# Altium schematic sheet Stripline_Driver.SchDoc
size A
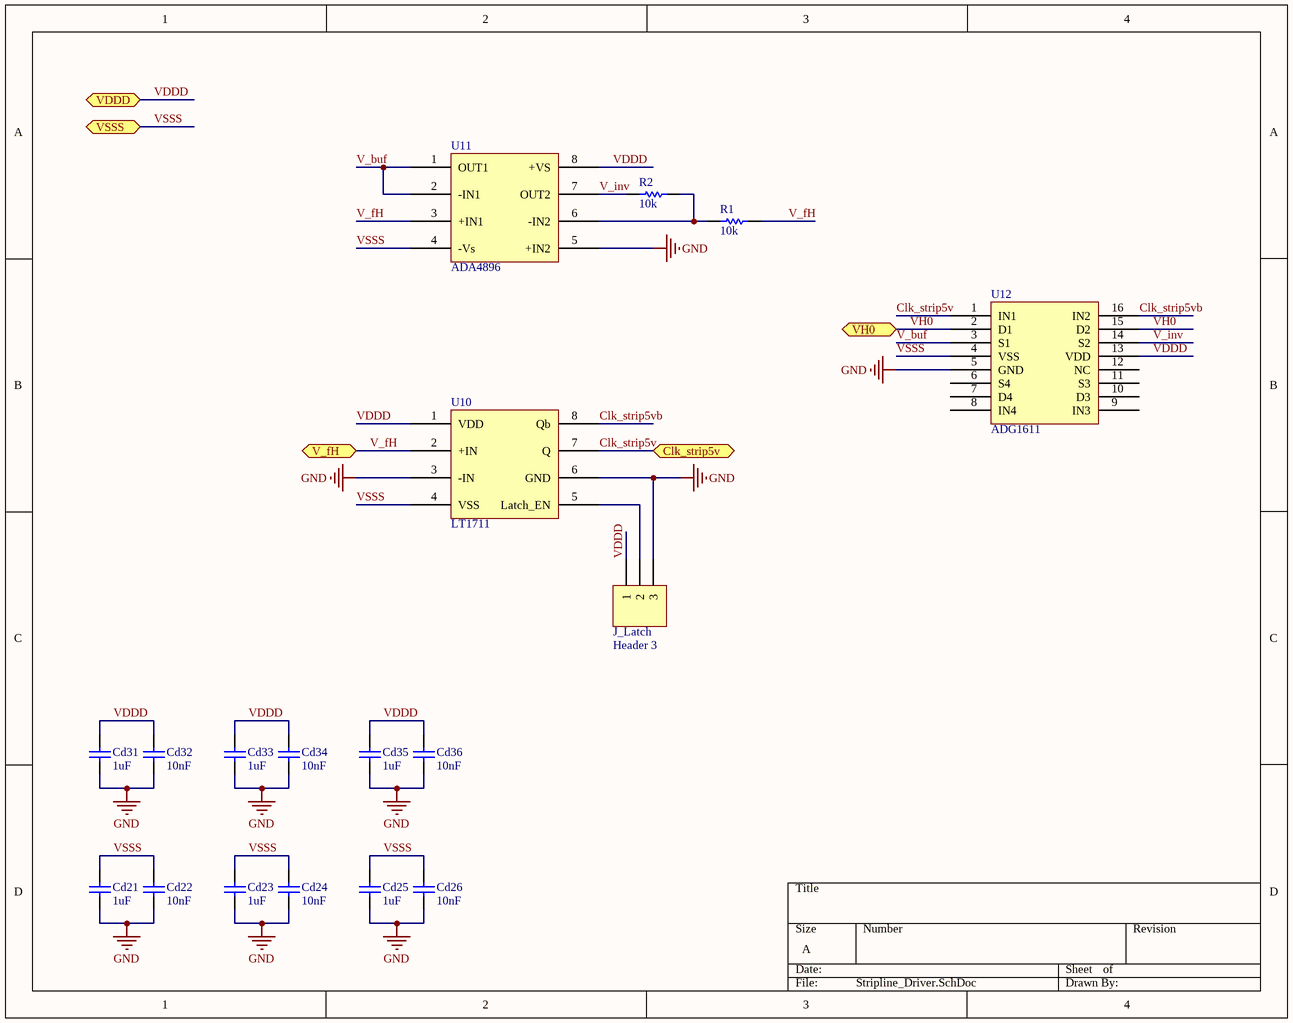
[diagram p0: Stripline_Driver.SchDoc]

## Parts
Cd21  value 1uF  [1608[0603]]  (hidden comment: Cap)
Cd22  value 10nF  [1608[0603]]  (hidden comment: Cap)
Cd23  value 1uF  [1608[0603]]  (hidden comment: Cap)
Cd24  value 10nF  [1608[0603]]  (hidden comment: Cap)
Cd25  value 1uF  [1608[0603]]  (hidden comment: Cap)
Cd26  value 10nF  [1608[0603]]  (hidden comment: Cap)
Cd31  value 1uF  [1608[0603]]  (hidden comment: Cap)
Cd32  value 10nF  [1608[0603]]  (hidden comment: Cap)
Cd33  value 1uF  [1608[0603]]  (hidden comment: Cap)
Cd34  value 10nF  [1608[0603]]  (hidden comment: Cap)
Cd35  value 1uF  [1608[0603]]  (hidden comment: Cap)
Cd36  value 10nF  [1608[0603]]  (hidden comment: Cap)
J_Latch  Header 3  [HDR1X3]
R1  value 10k  [1608[0603]]  (hidden comment: Res1)
R2  value 10k  [1608[0603]]  (hidden comment: Res1)
U10  LT1711  [RM-8]
U11  ADA4896  [RM-8]
U12  ADG1611  [RU-16]

## Ports
Clk_strip5v (bidir), V_fH (bidir), VDDD (bidir), VH0 (bidir), VSSS (bidir)

## Nets
GND: Cd21.2 Cd22.2 Cd23.2 Cd24.2 Cd25.2 Cd26.2 Cd31.2 Cd32.2 Cd33.2 Cd34.2 Cd35.2 Cd36.2 J_Latch.3 U10.3(-IN) U10.6(GND) U11.5(+IN2) U12.5(GND)
Clk_strip5v: U10.7(Q) U12.1(IN1) ; port Clk_strip5v
Clk_strip5vb: U10.8(Qb) U12.16(IN2)
V_buf: U11.1(OUT1) U11.2(-IN1) U12.3(S1)
V_fH: R1.2 U10.2(+IN) U11.3(+IN1) ; port V_fH
V_inv: R2.2 U11.7(OUT2) U12.14(S2)
VDDD: Cd31.1 Cd32.1 Cd33.1 Cd34.1 Cd35.1 Cd36.1 J_Latch.1 U10.1(VDD) U11.8(+VS) U12.13(VDD) ; port VDDD
VH0: U12.2(D1) U12.15(D2) ; port VH0
VSSS: Cd21.1 Cd22.1 Cd23.1 Cd24.1 Cd25.1 Cd26.1 U10.4(VSS) U11.4(-Vs) U12.4(VSS) ; port VSSS
NetJ_Latch_2: J_Latch.2 U10.5(Latch_EN)
NetR1_1: R1.1 R2.1 U11.6(-IN2)

Not connected (* = marked no-connect by the designer): U12 6(S4) 7(D4) 8(IN4) 9(IN3) 10(D3) 11(S3) 12(NC)

## Library data of the parts
Cd21-Cd26 Cd31-Cd36 = Cap: Capacitor; Published: 8-Jun-2000; LatestRevisionDate: 17-Jul-2002; LatestRevisionNote: Re-released for DXP Platform.; PackageReference: RAD-0.3; Publisher: Altium Limited; PackageDescription: Radial Cap, Thru-Hole; 2 Leads; 0.3 in Pin Spacing; Digi-Key: 445-7534-1-ND
J_Latch = Header 3: Header, 3-Pin; LatestRevisionDate: 17-Jul-2002; LatestRevisionNote: Re-released for DXP Platform.; Publisher: Altium Limited
R1 R2 = Res1: Resistor; Published: 8-Jun-2000; LatestRevisionDate: 17-Jul-2002; LatestRevisionNote: Re-released for DXP Platform.; PackageReference: AXIAL-0.3; Publisher: Altium Limited; PackageDescription: Axial Device, Thru-Hole; 2 Leads; 0.3 in Pin Spacing; Digikey PN: P1.00KCCT-ND
U11 = ADA4862